# Altium schematic sheet Processador.SchDoc
size A4
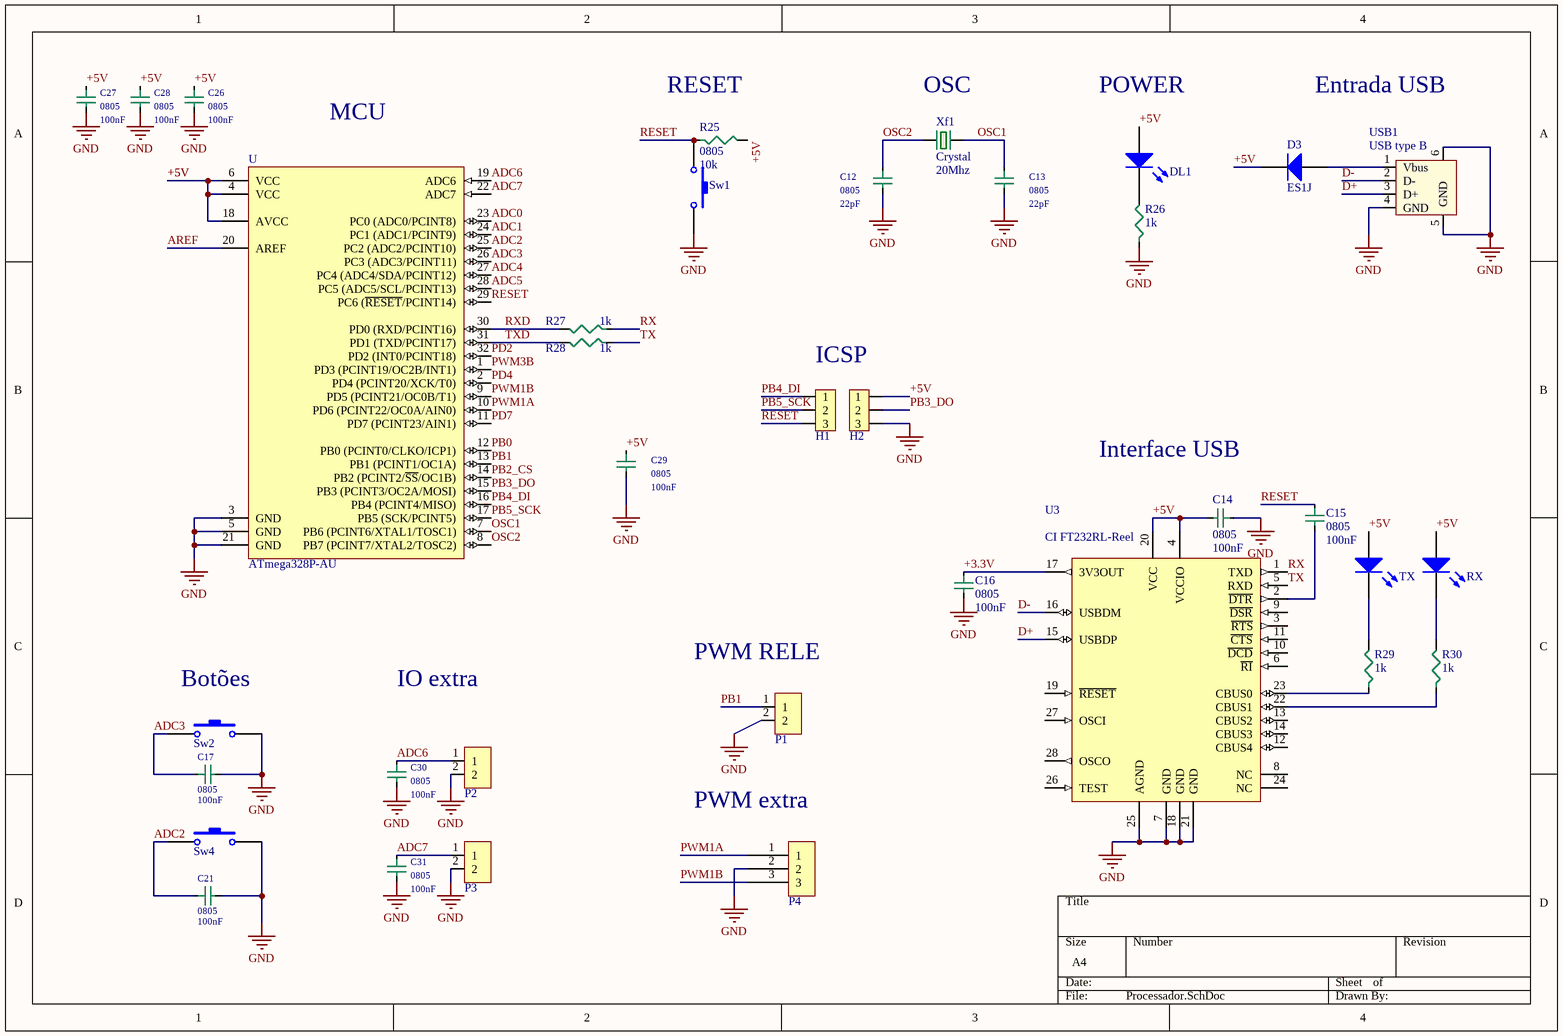
[diagram p0: Processador.SchDoc]

## Parts
C12  0805  value 22pF  [0805C]
C13  0805  value 22pF  [0805C]
C14  0805  value 100nF  [0805C]
C15  0805  value 100nF  [0805C]
C16  0805  value 100nF  [0805C]
C17  0805  value 100nF  [0805C]
C21  0805  value 100nF  [0805C]
C26  0805  value 100nF  [0805C]
C27  0805  value 100nF  [0805C]
C28  0805  value 100nF  [0805C]
C29  0805  value 100nF  [0805C]
C30  0805  value 100nF  [0805C]
C31  0805  value 100nF  [0805C]
D3  ES1J  [DO-214AC]
DL1  LED 0805  [LED SMD 0805]  (value not drawn)
H1  Header 3 pins  [Header 3]  (value not drawn)
H2  Header 3 pins  [Header 3]  (value not drawn)
P1  Molex_2  [Molex_2]  (value not drawn)
P2  Molex_2  [Molex_2]  (value not drawn)
P3  Molex_2  [Molex_2]  (value not drawn)
P4  Molex_3  [Molex_3]  (value not drawn)
R25  0805  value 10k  [0805]
R26  value 1k  [0805]  (hidden comment: 0805)
R27  value 1k  [0805]  (hidden comment: 0805)
R28  value 1k  [0805]  (hidden comment: 0805)
R29  value 1k  [0805]  (hidden comment: 0805)
R30  value 1k  [0805]  (hidden comment: 0805)
RX  LED 0805  [LED SMD 0805]  (value not drawn)
Sw1  SW_PUSH_BUTTON  [PUSH_BUTTON]  (value not drawn)
Sw2  SW_PUSH_BUTTON  [PUSH_BUTTON]  (value not drawn)
Sw4  SW_PUSH_BUTTON  [PUSH_BUTTON]  (value not drawn)
TX  LED 0805  [LED SMD 0805]  (value not drawn)
U  ATmega328P-AU  [32A_N]
U3  CI FT232RL-Reel  [SSOP-28_N]
USB1  USB type B  [USB2.5-2H4D]
Xf1  Crystal  [CRYSTAL HIGH]

## Nets
GND: C12.2 C13.2 C14.1 C16.2 C17.2 C21.2 C26.2 C27.2 C28.2 C29.2 C30.2 C31.2 H2.3 P1.2 P2.2 P3.2 P4.2 R26.1 Sw1.2 Sw2.2 Sw4.2 U.3(GND) U.5(GND) U.21(GND) U3.7(GND) U3.18(GND) U3.21(GND) U3.25(AGND) USB1.4(GND) USB1.5(GND) USB1.6
+3.3V: C16.1 U3.17(3V3OUT)
+5V: C14.2 C26.1 C27.1 C28.1 C29.1 D3.2(K) DL1.1(A) H2.1 R25.2 RX.1(A) TX.1(A) U.4(VCC) U.6(VCC) U.18(AVCC) U3.4(VCCIO) U3.20(VCC)
ADC0: U.23(PC0_(ADC0/PCINT8))
ADC1: U.24(PC1_(ADC1/PCINT9))
ADC2: C21.1 Sw4.1 U.25(PC2_(ADC2/PCINT10))
ADC3: C17.1 Sw2.1 U.26(PC3_(ADC3/PCINT11))
ADC4: U.27(PC4_(ADC4/SDA/PCINT12))
ADC5: U.28(PC5_(ADC5/SCL/PCINT13))
ADC6: C30.1 P2.1 U.19(ADC6)
ADC7: C31.1 P3.1 U.22(ADC7)
AREF: U.20(AREF)
D+: U3.15(USBDP) USB1.3(D+)
D-: U3.16(USBDM) USB1.2(D-)
OSC1: C13.1 U.7(PB6_(PCINT6/XTAL1/TOSC1)) Xf1.1
OSC2: C12.1 U.8(PB7_(PCINT7/XTAL2/TOSC2)) Xf1.2
PB0: U.12(PB0_(PCINT0/CLKO/ICP1))
PB1: P1.1 U.13(PB1_(PCINT1/OC1A))
PB2_CS: U.14(PB2_(PCINT2/~{SS}/OC1B))
PB3_DO: H2.2 U.15(PB3_(PCINT3/OC2A/MOSI))
PB4_DI: H1.1 U.16(PB4_(PCINT4/MISO))
PB5_SCK: H1.2 U.17(PB5_(SCK/PCINT5))
PD2: U.32(PD2_(INT0/PCINT18))
PD4: U.2(PD4_(PCINT20/XCK/T0))
PD7: U.11(PD7_(PCINT23/AIN1))
PWM1A: P4.1 U.10(PD6_(PCINT22/OC0A/AIN0))
PWM1B: P4.3 U.9(PD5_(PCINT21/OC0B/T1))
PWM3B: U.1(PD3_(PCINT19/OC2B/INT1))
RESET: C15.1 H1.3 R25.1 Sw1.1 U.29(PC6_(~{RESET}/PCINT14))
RX: R27.1 U3.1(TXD)
RXD: R27.2 U.30(PD0_(RXD/PCINT16))
TX: R28.1 U3.5(RXD)
TXD: R28.2 U.31(PD1_(TXD/PCINT17))
NetC15_2: C15.2 U3.2(~{DTR})
NetD3_1: D3.1(A) USB1.1(Vbus)
NetDL1_2: DL1.2(K) R26.2
NetR29_1: R29.1 U3.23(CBUS0)
NetR29_2: R29.2 TX.2(K)
NetR30_1: R30.1 U3.22(CBUS1)
NetR30_2: R30.2 RX.2(K)

Not connected (* = marked no-connect by the designer): U3 3(~{RTS}) 6(~{RI}) 8(NC) 9(~{DSR}) 10(~{DCD}) 11(~{CTS}) 12(CBUS4) 13(CBUS2) 14(CBUS3) 19(~{RESET}) 24(NC) 26(TEST) 27(OSCI) 28(OSCO)

## Notes on the sheet
- (near R25) RESET
- (near Xf1) OSC
- POWER
- Entrada USB
- MCU
- ICSP
- Interface USB
- (near Sw2) Botões
- IO extra
- (near P1) PWM RELE
- (near P4) PWM extra
- (in symbol Crystal Oscillator) 20Mhz

## Library data of the parts
C12-C17 C21 C26-C31 = Capacitor SMD 0805
D3 = Diode ES1J: Rectifiers 1.0 A Ultra Fast Recovery Rect; ComponentLink1Description: MOUSER; ComponentLink1URL: https://br.mouser.com/ProductDetail/512-ES1J; ComponentLink2Description: DATASHEET; ComponentLink2URL: https://br.mouser.com/datasheet/2/308/ES1J-D-1804952.pdf
DL1 RX TX = LED 0805 SMD: Typical INFRARED GaAs LED; Published: 8-Jun-2000; LatestRevisionDate: 08-Jul-2005; LatestRevisionNote: Mech Layer 1 removed.; PackageReference: LED-0; Publisher: Altium Limited
H1 H2 = Header 1x3 Macho
R25-R30 = Resistor SMD 0805 1/8 W: %: ±1%; P: 1/8W
Sw1 Sw2 Sw4 = SW-PB: Switch Push Button; Published: 24-Mar-1999; LatestRevisionDate: 17-Jul-2002; LatestRevisionNote: Re-released for DXP Platform.; PackageReference: SPST-2; Publisher: Altium Limited
U = ATmega328P-AU: 8-bit AVR Microcontroller, 32KB Flash, 1KB EEPROM, 2KB SRAM, 32-pin TQFP, Industrial Grade (-40°C to 85°C); Published: 1-Apr-2010; DatasheetVersion: revA, Jan-2010; PackageVersion: revB, Oct-2001; PackageReference: 32A; Publisher: Altium Limited; PackageDescription: 32-Lead, 7x7x1.0 mm Body, 0.8mm Lead Pitch, Thin Profile Plastic Quad Flat Package (TQFP); Supplier 1: Digi-Key; Supplier Part Number 1: ATMEGA328P-AU-ND; Supplier 2: Farnell; Supplier Part Number 2: 1715486; Supplier 3: Mouser; Supplier Part Number 3: 556-ATMEGA328P-AU; Code_JEDEC: MS-026-ABA; ComponentLink1Description: Manufacturer Link; ComponentLink1URL: http://www.atmel.com/products/avr/default.asp?; ComponentLink2Description: ATmega48A/48PA/88A/88PA/168A/168PA/328/328P Datasheet; ComponentLink2URL: http://www.atmel.com/dyn/resources/prod_documents/8271.pdf; ComponentLink3Description: ATmega48A/48PA/88A/88PA/168A/168PA/328/328P Summary; ComponentLink3URL: http://www.atmel.com/dyn/resources/prod_documents/8271S.pdf; ComponentLink4Description: Atmel.com Home; ComponentLink4URL: http://www.atmel.com
U3 = CI FT232RL-Reel: USB UART Asynchronous Serial Data Transfer Chip, SSOP-28, Tape and Reel; Published: 19-Aug-2010; DatasheetVersion: ver 2.07, Jul-2010; PackageVersion: 2010; PackageReference: SSOP-28; Publisher: Altium Limited; PackageDescription: 28-Pin Small Outline Package 0.65 mm Pitch; ComponentLink1Description: Manufacturer Link; ComponentLink1URL: http://www.ftdichip.com/Products/ICs/FT232R.htm; ComponentLink2Description: Datasheet; ComponentLink2URL: http://www.ftdichip.com/Support/Documents/DataSheets/ICs/DS_FT232R.pdf
Xf1 = Crystal Oscillator